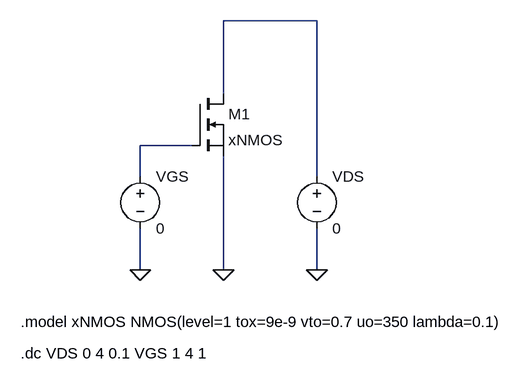
[diagram p0: schematic Chapter01A.asc]
Chapter01A.asc, the LTspice schematic file:
Version 4
SHEET 1 880 680
WIRE 352 -16 208 -16
WIRE 208 96 208 -16
WIRE 160 176 80 176
WIRE 80 224 80 176
WIRE 352 224 352 -16
WIRE 80 368 80 304
WIRE 208 368 208 192
WIRE 352 368 352 304
FLAG 208 368 0
FLAG 80 368 0
FLAG 352 368 0
SYMBOL nmos 160 96 R0
SYMATTR InstName M1
SYMATTR Value xNMOS
SYMBOL voltage 80 208 R0
WINDOW 123 0 0 Left 0
WINDOW 39 0 0 Left 0
SYMATTR InstName VGS
SYMATTR Value 0
SYMBOL voltage 352 208 R0
SYMATTR InstName VDS
SYMATTR Value 0
TEXT -104 448 Left 2 !.model xNMOS NMOS(level=1 tox=9e-9 vto=0.7 uo=350 lambda=0.1)
TEXT -104 496 Left 2 !.dc VDS 0 4 0.1 VGS 1 4 1

The netlist it stands for:
* Chapter01A.asc
M1 N001 N002 0 0 xNMOS
VGS N002 0 0
VDS N001 0 0
.model NMOS NMOS
.model PMOS PMOS
.lib standard.mos
.model xNMOS NMOS(level=1 tox=9e-9 vto=0.7 uo=350 lambda=0.1)
.dc VDS 0 4 0.1 VGS 1 4 1
.backanno
.end